# EAGLE design TCS3471-3V-v1.0 (EAGLE 6.2)
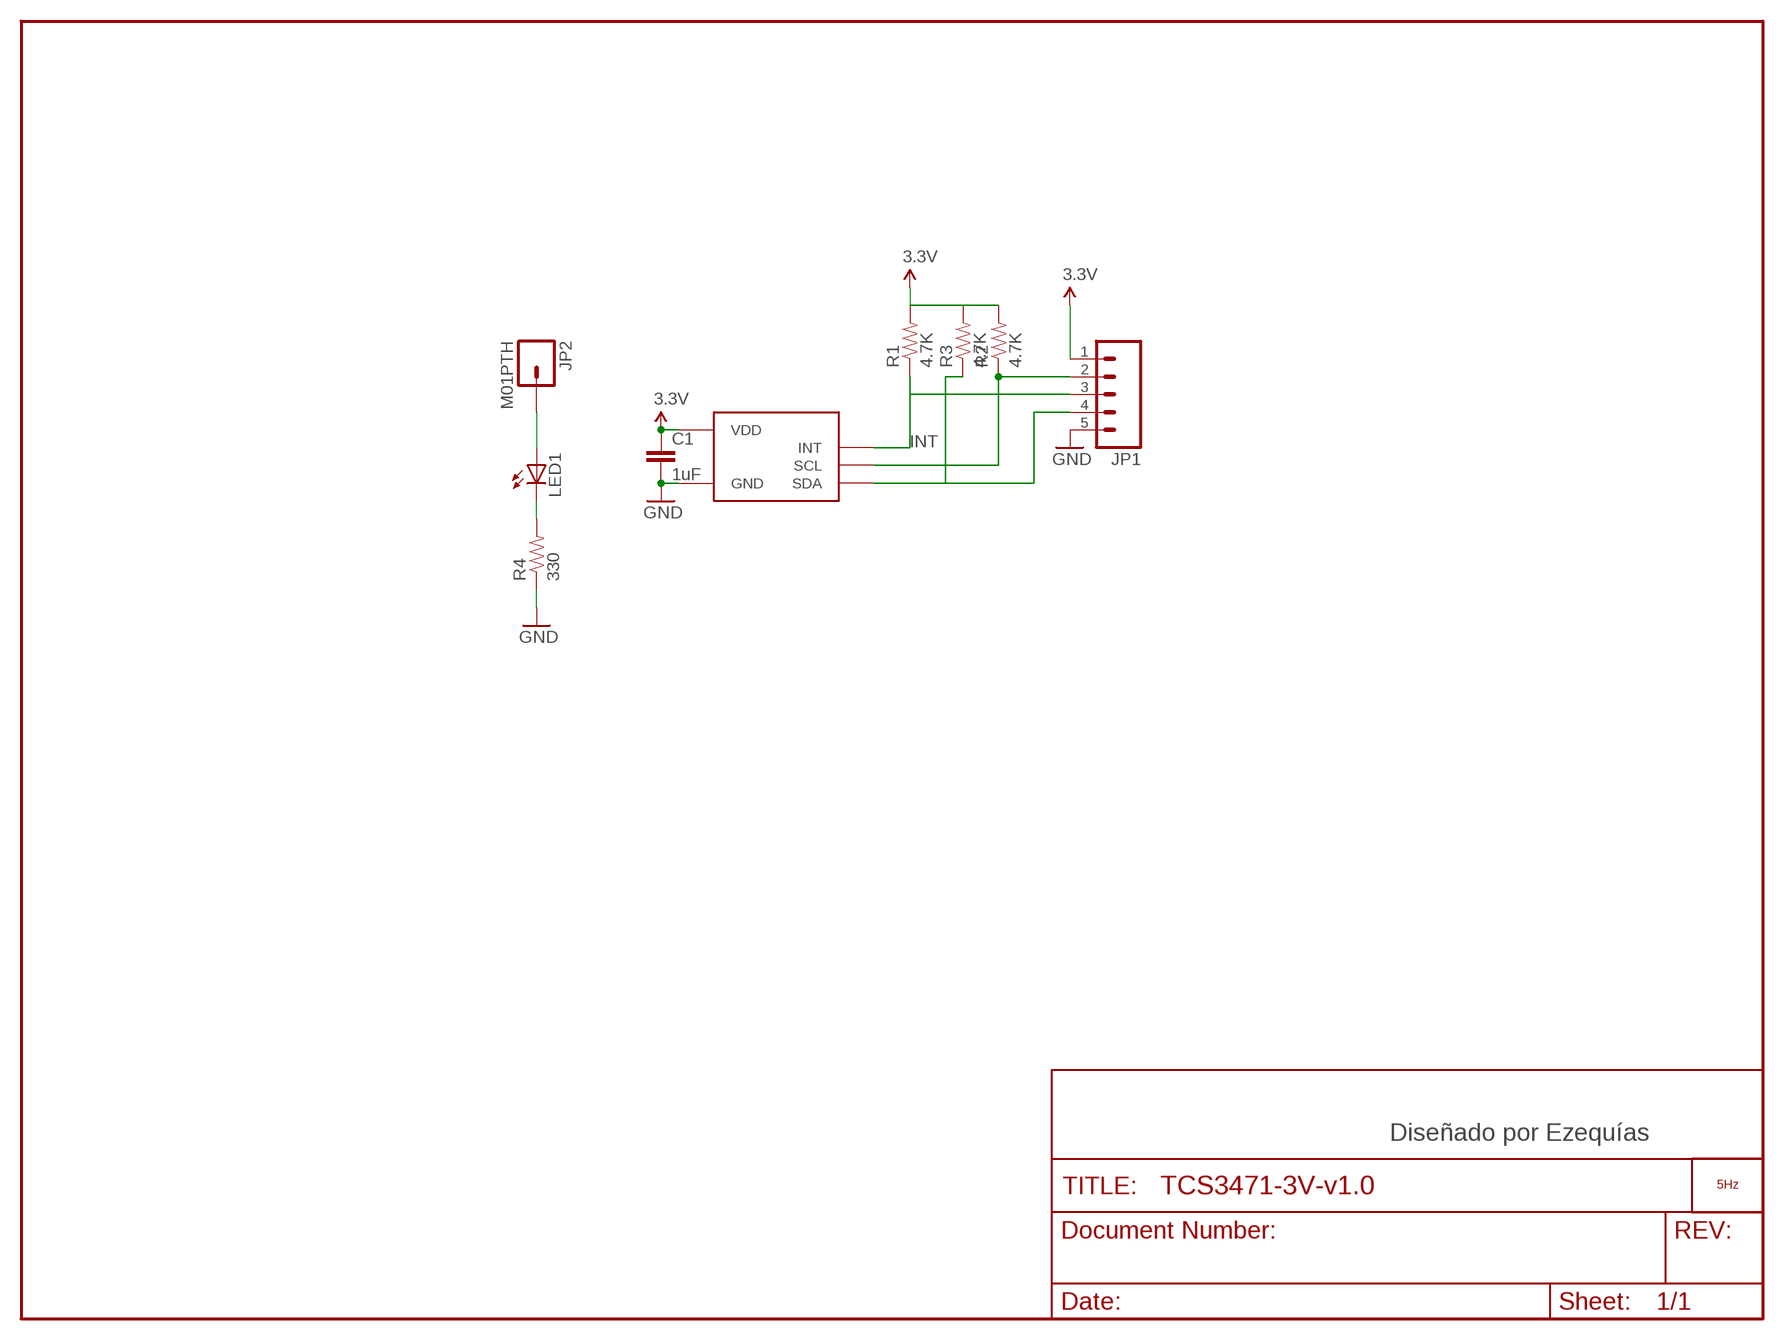
[diagram p0: schematic, sheet 1]

## Parts
C1  1uF  CAP0603-CAP  [0603-CAP]
JP1  M05PTH  [1X05]
JP2  M01PTH  [1X01]
LED1  LED0603  [LED-0603]
LOGO1  LOGO_5HZ_H_5MM  [5HZ_LOGO_H_5MM]
R1  4.7K  RESISTOR0603-RES  [0603-RES]
R2  4.7K  RESISTOR0603-RES  [0603-RES]
R3  4.7K  RESISTOR0603-RES  [0603-RES]
R4  330  RESISTOR0603-RES  [0603-RES]
U$1  TCS3471  [TCS3471]

## Nets
3.3V: C1.1 JP1.1 R1.2 R2.2 R3.2 U$1.P$1(VDD)
GND: C1.2 JP1.5 R4.1 U$1.P$3(GND)
INT: JP1.3 R1.1 U$1.P$5(INT)
N$1: LED1.C R4.2
N$2: JP2.1 LED1.A
N$4: JP1.2 R2.1 U$1.P$2(SCL)
SDA: JP1.4 R3.1 U$1.P$6(SDA)

## Notes on the sheet
- Diseñado por Ezequías

## Library data of the parts
C1 = SparkFun:CAP: Capacitor Standard 0603 ceramic capacitor, and 0.1" leaded capacitor.
JP1 = SparkFun:M05: Header 5 Standard 5-pin 0.1" header. Use with straight break away headers (SKU : PRT-00116), right angle break away headers (PRT-00553), swiss pins (PRT-00743), machine pins (PRT-00117), and female headers (PRT-00115). Molex polarized connector foot print use with SKU : PRT-08230 with associated crimp pins and housings.
JP2 = SparkFun:M01: Header 1 Standard 1-pin 0.1" header. Use with straight break away headers (SKU : PRT-00116), right angle break away headers (PRT-00553), swiss pins (PRT-00743), machine pins (PRT-00117), and female headers (PRT-00115).
LED1 = SparkFun:LED: LEDs Standard schematic elements and footprints for 5mm, 3mm, 1206, and 0603 sized LEDs. 5mm - Spark Fun Electronics SKU : COM-00529 (and others)
LOGO1 = 5hz-electronica:LOGO_5HZ: Logotipo 5Hz "según Pedro"
R1-R4 = SparkFun:RESISTOR: Resistor Basic schematic elements and footprints for 0603, 1206, and PTH resistors.
U$1 = MAÑE:TCS3471

## Board
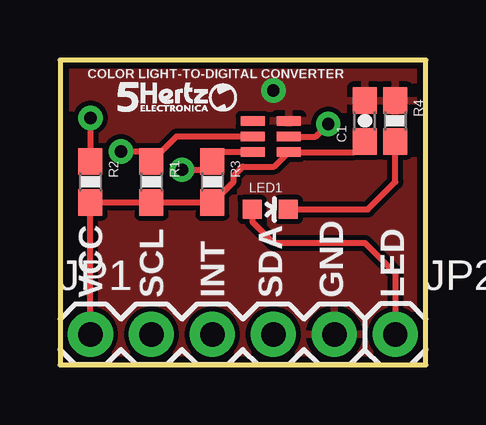
[diagram p1: board, top side]
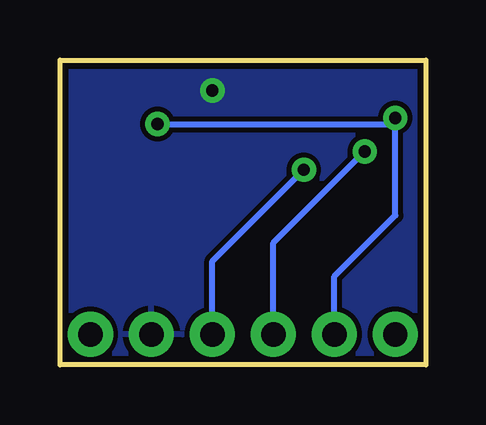
[diagram p2: board, bottom side, seen from below]

Size 15.24 x 12.7 mm. Coordinates in mm from the lower left corner, seen from the top.
Outline: 0,0 15.24,0 15.24,12.7 0,12.7 0,0
Copper layers (1*16): Top 0.035mm / dielectric 1.5mm / Bottom 0.035mm
Design rules: minimum track width 8mil, minimum drill 20mil, track to track 8mil, track to pad 8mil, pad to pad 8mil, via to via 8mil, smd to smd 8mil, copper to edge 10mil, drill to drill 8mil, minimum pad ring 12mil, minimum via ring 10mil, stop-mask expansion 4mil, vias tented up to drill 25mil, thermal gap 10mil

### Footprints (pad centres in the part's own frame; a part is rotated, then mirrored left to right if it is on the bottom)
0603-CAP = smd 1.1 x 1: 1 -0.85,0; 2 0.85,0
1X05 = drill 1.016 pad 1.88: 1 0,0; 2 2.54,0; 3 5.08,0; 4 7.62,0; 5 10.16,0
1X01 = drill 1.016 pad 1.88: 1 0,0
LED-0603 = smd 0.8 x 0.8: A 0,-0.75; C 0,0.75
0603-RES = smd 1.1 x 1: 1 -0.85,0; 2 0.85,0
TCS3471 = smd 1 x 0.4: P$1 0,1.3; P$2 0,0.65; P$3 0,0; P$4 1.5,0; P$5 1.5,0.65; P$6 1.5,1.3

### Placement (x,y rotation side)
C1  12.7,10.16 90 top
JP1  1.27,1.27 0 top
JP2  13.97,1.27 0 top
LED1  8.76,6.48 270 top
LOGO1  2.41,10.54 0 top
R1  3.81,7.62 270 top
R2  1.27,7.62 270 top
R3  6.35,7.62 270 top
R4  13.97,10.16 270 top
U$1  9.53,10.16 180 top

### Tracks (layer width: path | path; a pad name or v marks a point on that pad's centre or on a via)
3.3V
  Top 0.254: JP1.1 R2.2 R1.2 R3.2 6.39,6.77 7.24,7.62 7.24,7.87 7.62,8.26 8.92,8.26 U$1.P$1 12.25,8.86 C1.1
GND  (via drill 0.51)
  other vias: 8.89,11.43
  pour Bottom: 0,0 0,12.7 15.24,12.7 15.24,0
  pour Top: 0,12.7 15.24,12.7 15.24,0 0,0
INT  (via drill 0.51)
  Top 0.254: U$1.P$5 4.85,9.51 R1.1 3.39,8.89 v2.54,8.89
  Bottom 0.254: JP1.3 6.35,5.08 v2.54,8.89
N$1
  Top 0.254: LED1.C 12.83,6.48 13.97,7.62 R4.2
N$2
  Top 0.254: LED1.A 8.01,5.96 8.89,5.08 12.7,5.08 13.97,3.81 JP2.1
N$4  (via drill 0.51)
  Top 0.254: v1.27,10.29 R2.1 | U$1.P$2 10.65,9.51 v11.18,10.03
  Bottom 0.254: JP1.2 3.81,3.68 1.27,6.22 v1.27,10.29 1.52,10.03 v11.18,10.03
SDA  (via drill 0.51)
  Top 0.254: U$1.P$6 6.74,8.86 R3.1 6.01,8.13 v5.08,8.13
  Bottom 0.254: JP1.4 8.89,4.32 v5.08,8.13

### Text on the board
tPlace: COLOR LIGHT-TO-DIGITAL CONVERTER | VCC | SCL | INT | SDA | GND | LED